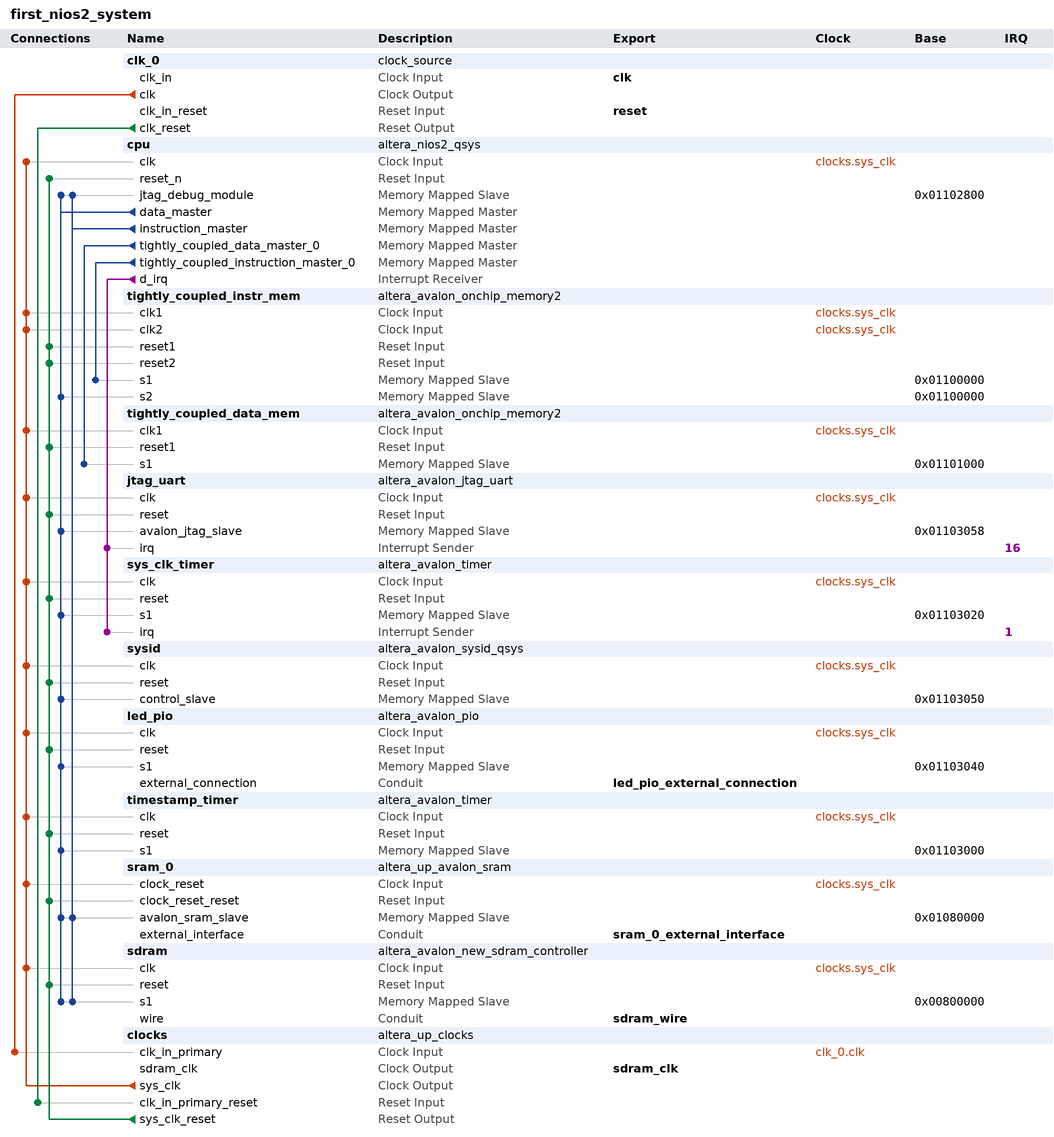
[diagram p0: system contents]
# Platform Designer (Qsys) system first_nios2_system, Cyclone II EP2C20F484C7
# Parameters at their usual value, and those the tool derives, are not listed.
package require -exact qsys 12.1
create_system first_nios2_system
set_project_property DEVICE_FAMILY {Cyclone II}
set_project_property DEVICE EP2C20F484C7

add_instance clk_0 clock_source 12.1
set_instance_parameter_value clk_0 clockFrequency 50000000

add_instance cpu altera_nios2_qsys 12.1
set_instance_parameter_value cpu resetSlave sdram.s1
set_instance_parameter_value cpu exceptionSlave sdram.s1
set_instance_parameter_value cpu breakSlave cpu.jtag_debug_module
set_instance_parameter_value cpu muldiv_multiplierType NoneSmall
set_instance_parameter_value cpu impl Fast
set_instance_parameter_value cpu icache_size 4096
set_instance_parameter_value cpu icache_numTCIM 1
set_instance_parameter_value cpu dcache_size 8192
set_instance_parameter_value cpu dcache_numTCDM 1
set_instance_parameter_value cpu dcache_lineSize 16

add_instance tightly_coupled_instr_mem altera_avalon_onchip_memory2 12.1
set_instance_parameter_value tightly_coupled_instr_mem dataWidth 32
set_instance_parameter_value tightly_coupled_instr_mem dualPort true
set_instance_parameter_value tightly_coupled_instr_mem initMemContent true
set_instance_parameter_value tightly_coupled_instr_mem initializationFileName tightly_coupled_instr_mem
set_instance_parameter_value tightly_coupled_instr_mem memorySize 4096

add_instance tightly_coupled_data_mem altera_avalon_onchip_memory2 12.1
set_instance_parameter_value tightly_coupled_data_mem dataWidth 32
set_instance_parameter_value tightly_coupled_data_mem dualPort false
set_instance_parameter_value tightly_coupled_data_mem initMemContent false
set_instance_parameter_value tightly_coupled_data_mem initializationFileName tightly_coupled_data_mem
set_instance_parameter_value tightly_coupled_data_mem memorySize 4096

add_instance jtag_uart altera_avalon_jtag_uart 12.1
set_instance_parameter_value jtag_uart simInteractiveOptions INTERACTIVE_ASCII_OUTPUT

add_instance sys_clk_timer altera_avalon_timer 12.1
set_instance_parameter_value sys_clk_timer period 1
set_instance_parameter_value sys_clk_timer periodUnits MSEC
set_instance_parameter_value sys_clk_timer timerPreset FULL_FEATURED

add_instance sysid altera_avalon_sysid_qsys 12.1
set_instance_parameter_value sysid id 1

add_instance led_pio altera_avalon_pio 12.1
set_instance_parameter_value led_pio direction Output
set_instance_parameter_value led_pio width 8

add_instance timestamp_timer altera_avalon_timer 12.1
set_instance_parameter_value timestamp_timer period 1
set_instance_parameter_value timestamp_timer periodUnits MSEC
set_instance_parameter_value timestamp_timer timerPreset CUSTOM

add_instance sram_0 altera_up_avalon_sram 12.0
set_instance_parameter_value sram_0 board DE1
set_instance_parameter_value sram_0 pixel_buffer false

add_instance sdram altera_avalon_new_sdram_controller 12.1
set_instance_parameter_value sdram TAC 5.5
set_instance_parameter_value sdram TRCD 20.0
set_instance_parameter_value sdram TRP 20.0
set_instance_parameter_value sdram casLatency 3
set_instance_parameter_value sdram columnWidth 8
set_instance_parameter_value sdram dataWidth 16
set_instance_parameter_value sdram generateSimulationModel false
set_instance_parameter_value sdram model custom
set_instance_parameter_value sdram numberOfBanks 4
set_instance_parameter_value sdram numberOfChipSelects 1
set_instance_parameter_value sdram powerUpDelay 100.0
set_instance_parameter_value sdram refreshPeriod 15.625
set_instance_parameter_value sdram rowWidth 12

add_instance clocks altera_up_clocks 12.0
set_instance_parameter_value clocks board DE1
set_instance_parameter_value clocks vga_clk false
set_instance_parameter_value clocks audio_clk false
set_instance_parameter_value clocks audio_clk_freq 12.288

# connections
add_connection clk_0.clk clocks.clk_in_primary clock
add_connection clocks.sys_clk cpu.clk clock
add_connection clocks.sys_clk jtag_uart.clk clock
add_connection clocks.sys_clk led_pio.clk clock
add_connection clocks.sys_clk sdram.clk clock
add_connection clocks.sys_clk sram_0.clock_reset clock
add_connection clocks.sys_clk sys_clk_timer.clk clock
add_connection clocks.sys_clk sysid.clk clock
add_connection clocks.sys_clk tightly_coupled_data_mem.clk1 clock
add_connection clocks.sys_clk tightly_coupled_instr_mem.clk1 clock
add_connection clocks.sys_clk tightly_coupled_instr_mem.clk2 clock
add_connection clocks.sys_clk timestamp_timer.clk clock
add_connection clk_0.clk_reset clocks.clk_in_primary_reset reset
add_connection clocks.sys_clk_reset cpu.reset_n reset
add_connection clocks.sys_clk_reset jtag_uart.reset reset
add_connection clocks.sys_clk_reset led_pio.reset reset
add_connection clocks.sys_clk_reset sdram.reset reset
add_connection clocks.sys_clk_reset sram_0.clock_reset_reset reset
add_connection clocks.sys_clk_reset sys_clk_timer.reset reset
add_connection clocks.sys_clk_reset sysid.reset reset
add_connection clocks.sys_clk_reset tightly_coupled_data_mem.reset1 reset
add_connection clocks.sys_clk_reset tightly_coupled_instr_mem.reset1 reset
add_connection clocks.sys_clk_reset tightly_coupled_instr_mem.reset2 reset
add_connection clocks.sys_clk_reset timestamp_timer.reset reset
add_connection cpu.data_master cpu.jtag_debug_module avalon
set_connection_parameter_value cpu.data_master/cpu.jtag_debug_module baseAddress 0x01102800
add_connection cpu.data_master jtag_uart.avalon_jtag_slave avalon
set_connection_parameter_value cpu.data_master/jtag_uart.avalon_jtag_slave baseAddress 0x01103058
add_connection cpu.data_master led_pio.s1 avalon
set_connection_parameter_value cpu.data_master/led_pio.s1 baseAddress 0x01103040
add_connection cpu.data_master sdram.s1 avalon
set_connection_parameter_value cpu.data_master/sdram.s1 baseAddress 0x00800000
add_connection cpu.data_master sram_0.avalon_sram_slave avalon
set_connection_parameter_value cpu.data_master/sram_0.avalon_sram_slave baseAddress 0x01080000
add_connection cpu.data_master sys_clk_timer.s1 avalon
set_connection_parameter_value cpu.data_master/sys_clk_timer.s1 baseAddress 0x01103020
add_connection cpu.data_master sysid.control_slave avalon
set_connection_parameter_value cpu.data_master/sysid.control_slave baseAddress 0x01103050
add_connection cpu.data_master tightly_coupled_instr_mem.s2 avalon
set_connection_parameter_value cpu.data_master/tightly_coupled_instr_mem.s2 baseAddress 0x01100000
add_connection cpu.data_master timestamp_timer.s1 avalon
set_connection_parameter_value cpu.data_master/timestamp_timer.s1 baseAddress 0x01103000
add_connection cpu.instruction_master cpu.jtag_debug_module avalon
set_connection_parameter_value cpu.instruction_master/cpu.jtag_debug_module baseAddress 0x01102800
add_connection cpu.instruction_master sdram.s1 avalon
set_connection_parameter_value cpu.instruction_master/sdram.s1 baseAddress 0x00800000
add_connection cpu.instruction_master sram_0.avalon_sram_slave avalon
set_connection_parameter_value cpu.instruction_master/sram_0.avalon_sram_slave baseAddress 0x01080000
add_connection cpu.tightly_coupled_data_master_0 tightly_coupled_data_mem.s1 avalon
set_connection_parameter_value cpu.tightly_coupled_data_master_0/tightly_coupled_data_mem.s1 baseAddress 0x01101000
add_connection cpu.tightly_coupled_instruction_master_0 tightly_coupled_instr_mem.s1 avalon
set_connection_parameter_value cpu.tightly_coupled_instruction_master_0/tightly_coupled_instr_mem.s1 baseAddress 0x01100000
add_connection cpu.d_irq jtag_uart.irq interrupt
set_connection_parameter_value cpu.d_irq/jtag_uart.irq irqNumber 16
add_connection cpu.d_irq sys_clk_timer.irq interrupt
set_connection_parameter_value cpu.d_irq/sys_clk_timer.irq irqNumber 1

# exported interfaces
add_interface clk clock sink
set_interface_property clk EXPORT_OF clk_0.clk_in
add_interface led_pio_external_connection conduit end
set_interface_property led_pio_external_connection EXPORT_OF led_pio.external_connection
add_interface reset reset sink
set_interface_property reset EXPORT_OF clk_0.clk_in_reset
add_interface sram_0_external_interface conduit end
set_interface_property sram_0_external_interface EXPORT_OF sram_0.external_interface
add_interface sdram_wire conduit end
set_interface_property sdram_wire EXPORT_OF sdram.wire
add_interface sdram_clk clock source
set_interface_property sdram_clk EXPORT_OF clocks.sdram_clk

save_system first_nios2_system.qsys
